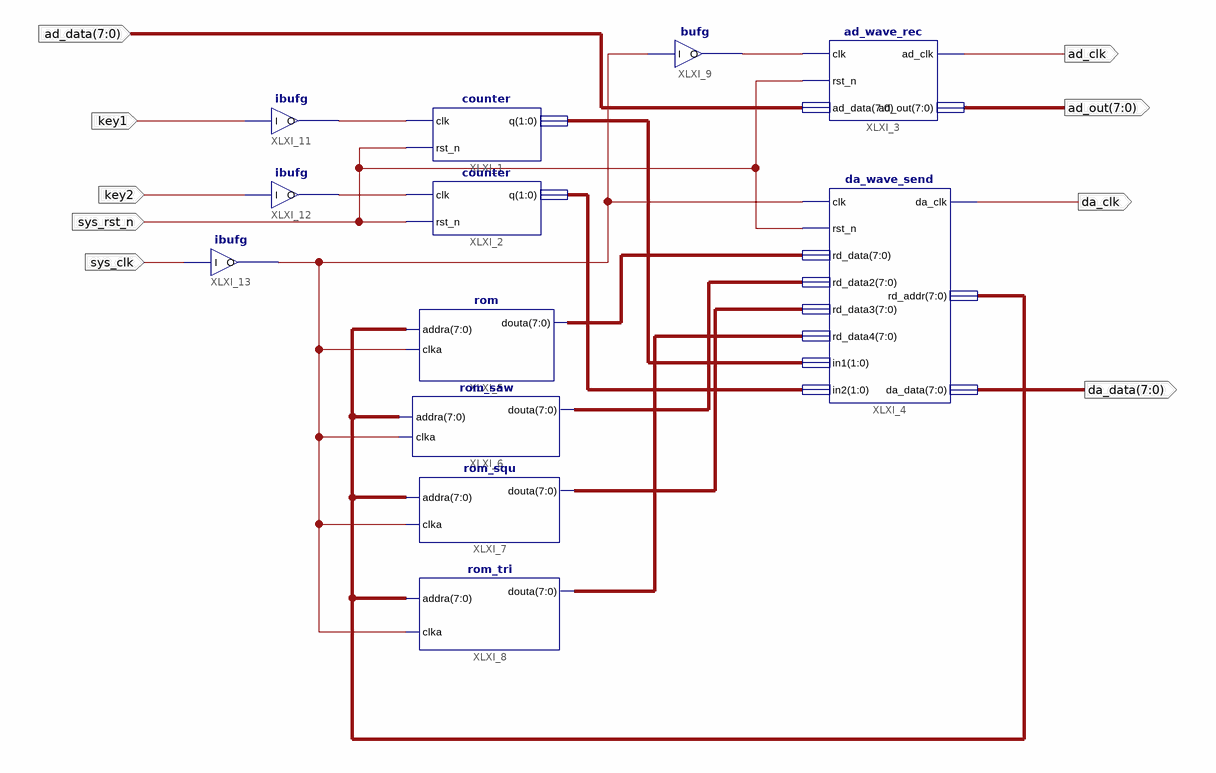
[diagram p0: schematic sheet 1]
// Xilinx ISE schematic ad_da.sch (spartan6) as structural Verilog: 12 symbols, 9 ports
module ad_da (
  input  key1,
  input  key2,
  input  sys_clk,
  input  sys_rst_n,
  input  [7:0] ad_data,
  output ad_clk,
  output [7:0] ad_out,
  output da_clk,
  output [7:0] da_data
);

  wire XLXN_16, XLXN_18, XLXN_23, XLXN_24;
  wire [1:0] XLXN_13, XLXN_14;
  wire [7:0] XLXN_5, XLXN_6, XLXN_8, XLXN_9, XLXN_10;

  counter XLXI_1 (.clk(XLXN_16), .rst_n(sys_rst_n), .q(XLXN_14));
  counter XLXI_2 (.clk(XLXN_18), .rst_n(sys_rst_n), .q(XLXN_13));
  ad_wave_rec XLXI_3 (.clk(XLXN_24), .rst_n(sys_rst_n), .ad_data(ad_data), .ad_clk(ad_clk), .ad_out(ad_out));
  da_wave_send XLXI_4 (
    .clk(XLXN_23), .rst_n(sys_rst_n), .rd_data(XLXN_6), .rd_data2(XLXN_8), .rd_data3(XLXN_9),
    .rd_data4(XLXN_10), .in1(XLXN_14), .in2(XLXN_13), .da_clk(da_clk), .rd_addr(XLXN_5), .da_data(da_data));
  rom XLXI_5 (.addra(XLXN_5), .douta(XLXN_6), .clka(XLXN_23));
  rom_saw XLXI_6 (.addra(XLXN_5), .douta(XLXN_8), .clka(XLXN_23));
  rom_squ XLXI_7 (.addra(XLXN_5), .douta(XLXN_9), .clka(XLXN_23));
  rom_tri XLXI_8 (.addra(XLXN_5), .douta(XLXN_10), .clka(XLXN_23));
  bufg XLXI_9 (.I(XLXN_23), .O(XLXN_24));
  ibufg XLXI_11 (.I(key1), .O(XLXN_16));
  ibufg XLXI_12 (.I(key2), .O(XLXN_18));
  ibufg XLXI_13 (.I(sys_clk), .O(XLXN_23));
endmodule
